# Altium schematic sheet Sheet1.SchDoc
size C; SheetNumber: 1; SheetTotal: 1; SPICEModelCacheWPHGAQRQ: <root> / <DocumentId>WPHGAQRQ</DocumentId> / <CacheFrame Number="0"> / <Model Name="diode" Kind="MDL"> / <Text>*Default Diode / *Diode Pinout: A,K / .MODEL DIODE D()</Text> / </Model> / </CacheFrame> / </root>
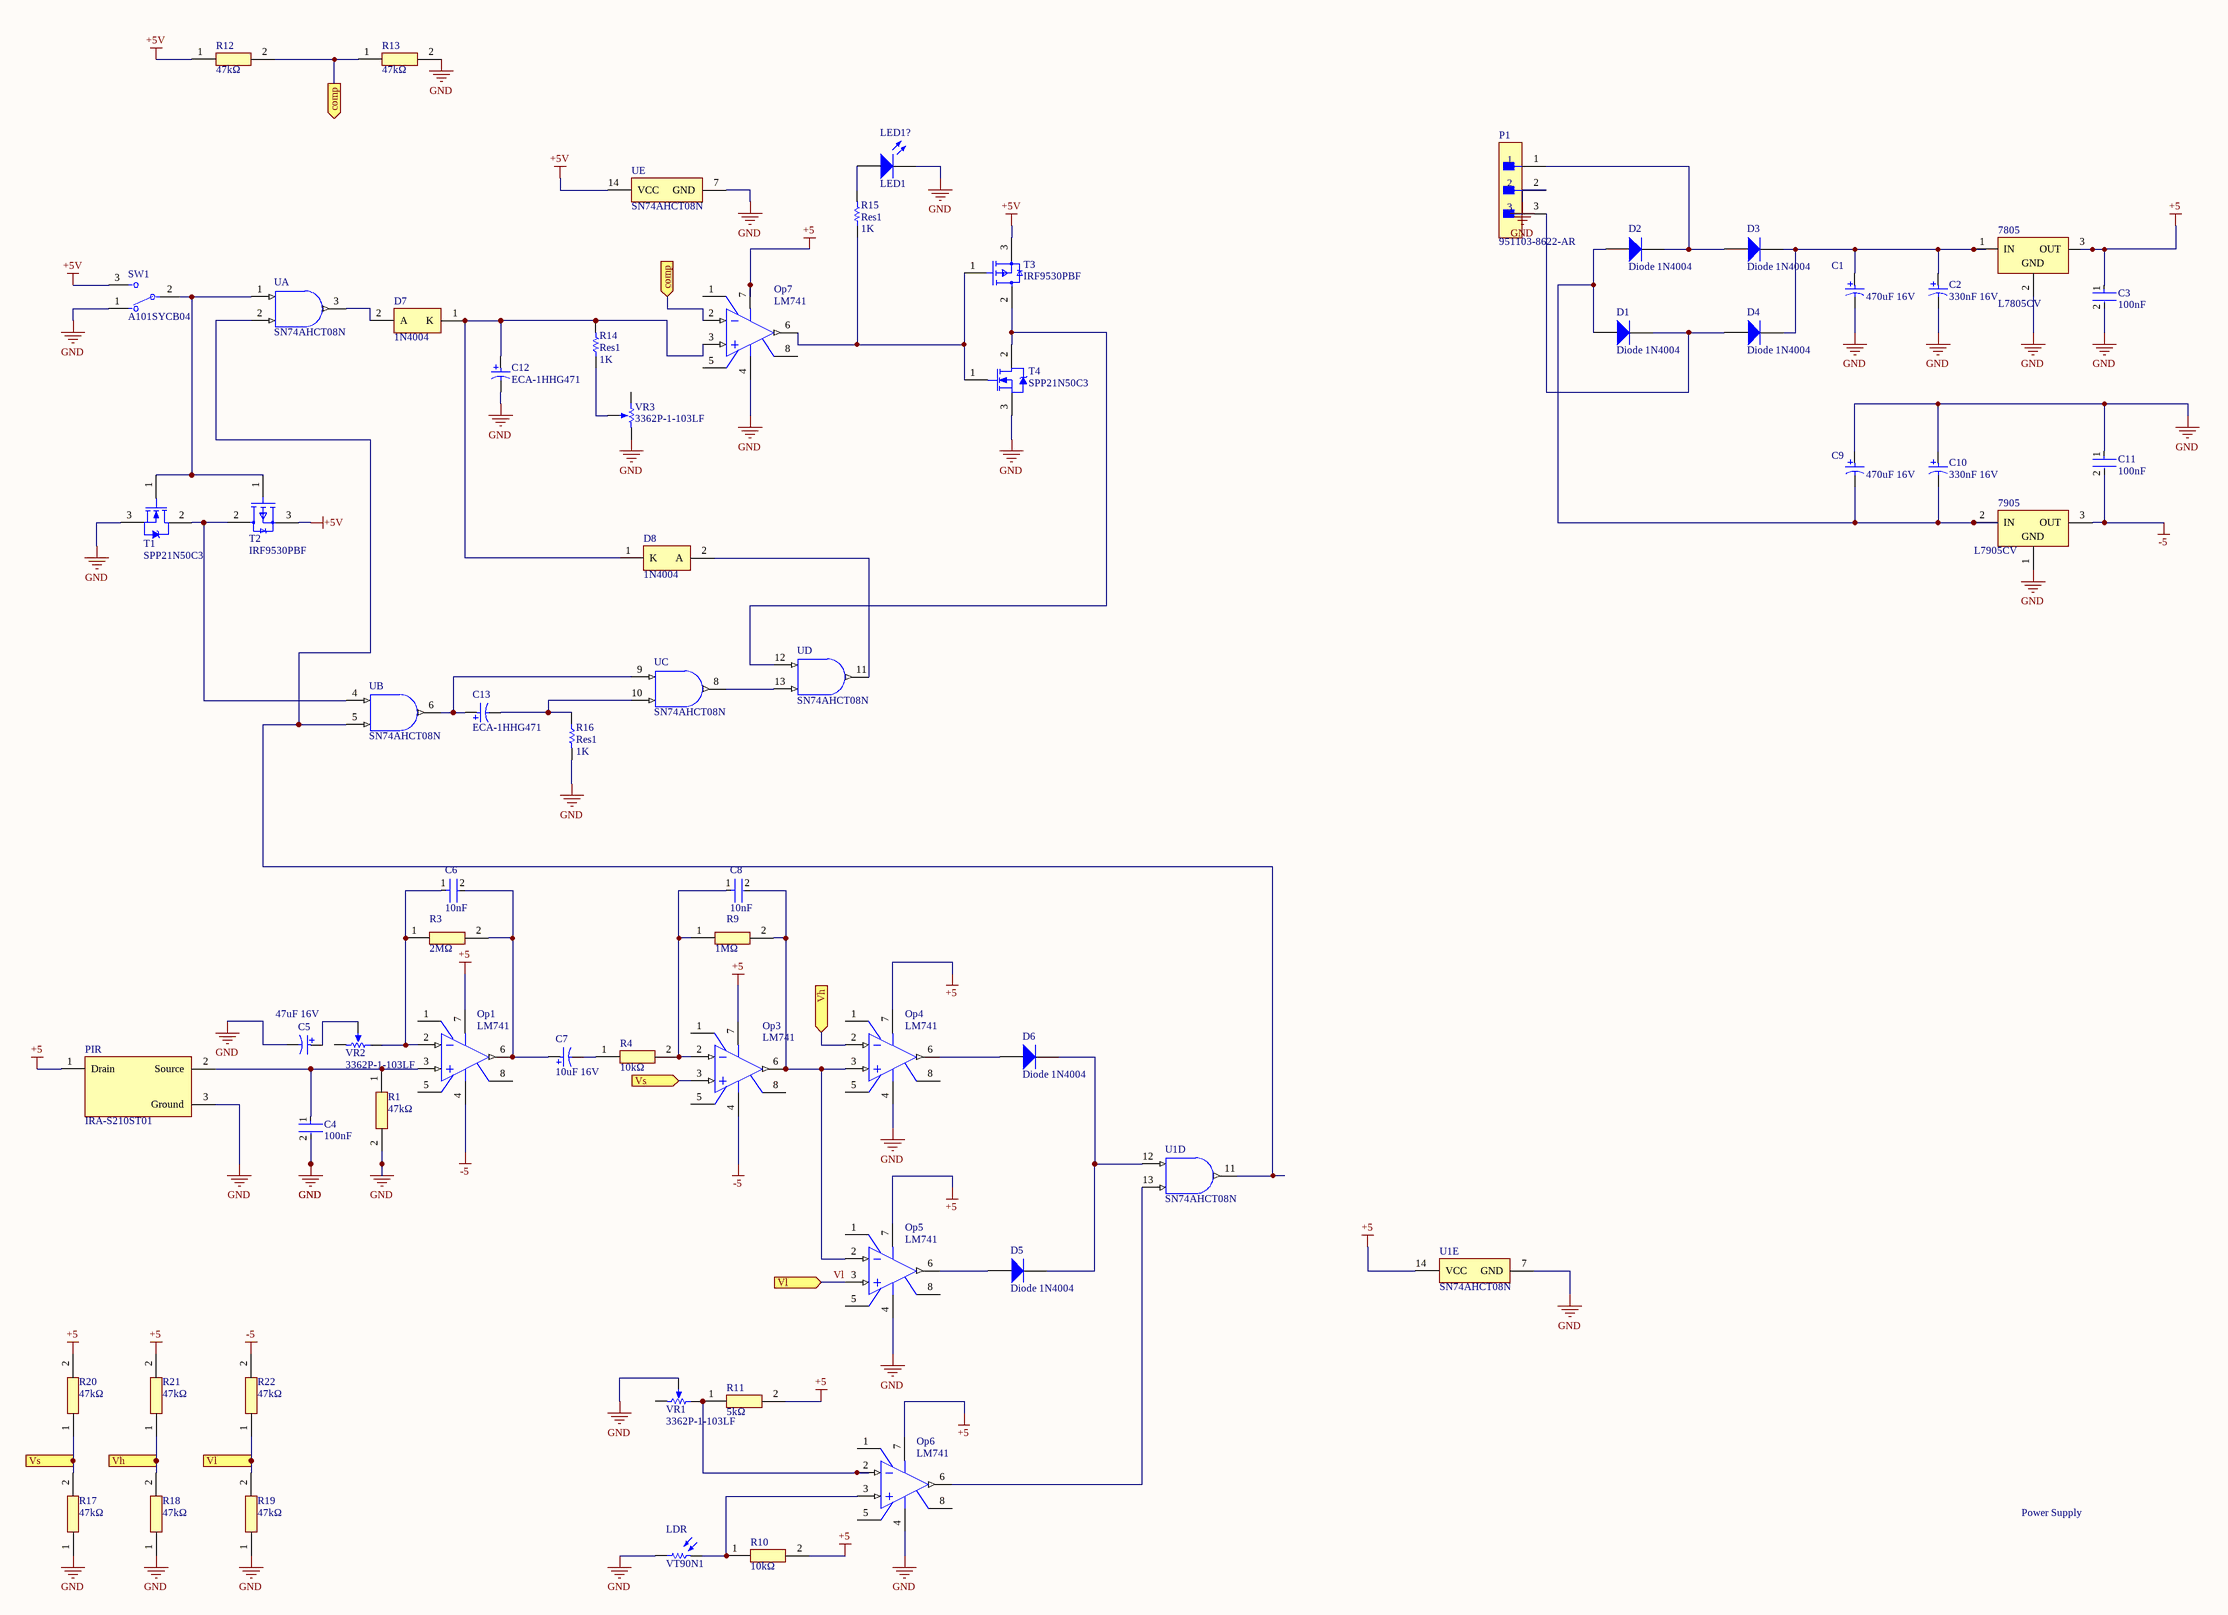
[diagram p0: Sheet1.SchDoc]

## Parts
7805  L7805CV  [TO220]
7905  L7905CV  [TO-220]
C1  470uF 16V  [CAPPR65-350-1150X800X1250]
C2  330nF 16V  [CAPPR65-350-1150X800X1250]
C3  100nF  [FP-K15H5-MFG]
C4  100nF  [FP-K15H5-MFG]
C5  47uF 16V  [CAPPR65-350-1150X800X1250]
C6  10nF  [FP-K15H5-MFG]
C7  10uF 16V  [CAPPR65-350-1150X800X1250]
C8  10nF  [FP-K15H5-MFG]
C9  470uF 16V  [CAPPR65-350-1150X800X1250]
C10  330nF 16V  [CAPPR65-350-1150X800X1250]
C11  100nF  [FP-K15H5-MFG]
C12  ECA-1HHG471  [PNSC-CAP-10x20-P2]
C13  ECA-1HHG471  [PNSC-CAP-10x20-P2]
D1  Diode 1N4004  [DO-41]
D2  Diode 1N4004  [DO-41]
D3  Diode 1N4004  [DO-41]
D4  Diode 1N4004  [DO-41]
D5  Diode 1N4004  [DO-41]
D6  Diode 1N4004  [DO-41]
D7  1N4004  [ONSC-AXIAL_LEAD-2-59-10_P]
D8  1N4004  [ONSC-AXIAL_LEAD-2-59-10_P]
LDR  VT90N1  [EXCE-VT90N1]
LED1?  LED1  [LED-1]
Op1  LM741  [P0008A]
Op3  LM741  [P0008A]
Op4  LM741  [P0008A]
Op5  LM741  [P0008A]
Op6  LM741  [P0008A]
Op7  LM741  [P0008A]
P1  951103-8622-AR  [FP-951103-8622-AR-MFG]
PIR  IRA-S210ST01  [FP-IRA-S210ST01-MFG]
R1  47kΩ  [RESAD1650W60L650D250]
R3  2MΩ  [RESAD1650W60L650D250]
R4  10kΩ  [RESAD1650W60L650D250]
R9  1MΩ  [RESAD1650W60L650D250]
R10  10kΩ  [RESAD1650W60L650D250]
R11  5kΩ  [RESAD1650W60L650D250]
R12  47kΩ  [RESAD1650W60L650D250]
R13  47kΩ  [RESAD1650W60L650D250]
R14  Res1  value 1K  [AXIAL-0.3]
R15  Res1  value 1K  [AXIAL-0.3]
R16  Res1  value 1K  [AXIAL-0.3]
R17  47kΩ  [RESAD1650W60L650D250]
R18  47kΩ  [RESAD1650W60L650D250]
R19  47kΩ  [RESAD1650W60L650D250]
R20  47kΩ  [RESAD1650W60L650D250]
R21  47kΩ  [RESAD1650W60L650D250]
R22  47kΩ  [RESAD1650W60L650D250]
SW1  A101SYCB04  [FP-A101SYCB04-MFG]
T1  SPP21N50C3  [INF-PG-TO220-3-1]
T2  IRF9530PBF  [FP-X15-0364-MFG]
T3  IRF9530PBF  [FP-X15-0364-MFG]
T4  SPP21N50C3  [INF-PG-TO220-3-1]
U  SN74AHCT08N  [N0014A]  (parts A,B,C,D,E of 5)
U1  SN74AHCT08N  [N0014A]  (parts D,E of 5)
VR1  3362P-1-103LF  [BOUR-3362P]
VR2  3362P-1-103LF  [BOUR-3362P]
VR3  3362P-1-103LF  [BOUR-3362P]

## Ports
comp (in), comp (out), Vh (in), Vh (out), Vl (in), Vl (out), Vs (in), Vs (out)

## Nets
+5: 7805.3(OUT) C3.1 Op1.7(V+) Op3.7(V+) Op4.7(V+) Op5.7(V+) Op6.7(V+) Op7.7(V+) PIR.1(Drain) R10.2 R11.2 R20.2 R21.2 U1.14(VCC)
+5V: R12.1 SW1.3 T2.3(S) T3.3(S) U.14(VCC)
-5: 7905.3(OUT) C11.2 Op1.4(V-) Op3.4(V-) R22.2
GND: 7805.2(GND) 7905.1(GND) C1.2 C2.2 C3.2 C4.2 C5.2 C9.1 C10.1 C11.1 C12.2 LDR.1 LED1?.2(K) Op4.4(V-) Op5.4(V-) Op6.4(V-) Op7.4(V-) P1.2 PIR.3(Ground) R1.2 R13.2 R16.2 R17.1 R18.1 R19.1 SW1.1 T1.3(SOURCE) T4.3(SOURCE) U.7(GND) U1.7(GND) VR1.2(S) VR3.3(CW)
comp: Op7.2(IN-) R12.2 R13.1 ; port comp
Vh: Op4.2(IN-) R18.2 R21.1 ; port Vh
Vl: Op5.3(IN+) R19.2 R22.1 ; port Vl
Vs: Op3.3(IN+) R17.2 R20.1 ; port Vs
Net7805_1: 7805.1(IN) C1.1 C2.1 D3.2(K) D4.2(K)
Net7905_2: 7905.2(IN) C9.2 C10.2 D1.1(A) D2.1(A)
NetC4_1: C4.1 Op1.3(IN+) PIR.2(Source) R1.1
NetC5_1: C5.1 VR2.2(S)
NetC6_1: C6.1 Op1.2(IN-) R3.1 VR2.1(CCW)
NetC6_2: C6.2 C7.1 Op1.6(OUT) R3.2
NetC7_2: C7.2 R4.1
NetC8_1: C8.1 Op3.2(IN-) R4.2 R9.1
NetC8_2: C8.2 Op3.6(OUT) Op4.3(IN+) Op5.2(IN-) R9.2
NetC12_1: C12.1 D7.1(K) D8.1(K) Op7.3(IN+) R14.2
NetC13_1: C13.1 U.6(2Y) U.9(3A)
NetC13_2: C13.2 R16.1 U.10(3B)
NetD1_2: D1.2(K) D4.1(A) P1.3
NetD2_2: D2.2(K) D3.1(A) P1.1
NetD5_1: D5.1(A) Op5.6(OUT)
NetD5_2: D5.2(K) D6.2(K) U1.12(4A)
NetD6_1: D6.1(A) Op4.6(OUT)
NetD7_2: D7.2(A) U.3(1Y)
NetD8_2: D8.2(A) U.11(4Y)
NetLDR_2: LDR.2 Op6.3(IN+) R10.1
NetLED1?_1: LED1?.1(A) R15.2
NetOp6_2: Op6.2(IN-) R11.1 VR1.1(CCW)
NetOp6_6: Op6.6(OUT) U1.13(4B)
NetOp7_6: Op7.6(OUT) R15.1 T3.1(G) T4.1(GATE)
NetR14_1: R14.1 VR3.2(S)
NetSW1_2: SW1.2 T1.1(GATE) T2.1(G) U.1(1A)
NetT1_2: T1.2(DRAIN) T2.2(D) U.4(2A)
NetT3_2: T3.2(D) T4.2(DRAIN) U.12(4A)
NetU_2: U.2(1B) U.5(2B) U1.11(4Y)
NetU_8: U.8(3Y) U.13(4B)

Not connected (* = marked no-connect by the designer): Op1 1(OFS_NULL) 5(OFS_NULL) 8(NC); Op3 1(OFS_NULL) 5(OFS_NULL) 8(NC); Op4 1(OFS_NULL) 5(OFS_NULL) 8(NC); Op5 1(OFS_NULL) 5(OFS_NULL) 8(NC); Op6 1(OFS_NULL) 5(OFS_NULL) 8(NC); Op7 1(OFS_NULL) 5(OFS_NULL) 8(NC); VR1 3(CW); VR2 3(CW); VR3 1(CCW)

## Notes on the sheet
- Power Supply

## Library data of the parts
7805 = CMP-0244-00483-1: Positive Voltage Regulator, 5V, 3-Pin TO-220; PackageDescription: TO, Thru-Hole, Vertical, Heatsink Mounted; 3 In-Line Leads; Pitch 2.54 mm; ComponentLink2Description: Datasheet; PackageReference: TO220; ComponentLink3URL: http://www.st.com/internet/com/TECHNICAL_RESOURCES/TECHNICAL_LITERATURE/PACKAGE_INFORMATION/CD00004649.pdf; DatasheetVersion: 16/11/2011; ComponentLink1Description: Manufacturer URL; ComponentLink1URL: http://www.st.com; PackageVersion: ver3.0; ComponentLink3Description: Package Specification; ComponentLink2URL: http://www.st.com/internet/com/TECHNICAL_RESOURCES/TECHNICAL_LITERATURE/DATASHEET/CD00000444.pdf
7905 = CMP-0244-00447-1: Negative Voltage Regulator, -5V, 3-Pin TO-220; ComponentLink2Description: Datasheet; DatasheetVersion: 1/11/2011; ComponentLink2URL: http://www.st.com/internet/com/TECHNICAL_RESOURCES/TECHNICAL_LITERATURE/DATASHEET/CD00000450.pdf; ComponentLink1Description: Manufacturer URL; PackageDescription: TO, Thru-Hole, Vertical, Heatsink Mounted; 3 In-Line Leads; Pitch 2.54 mm; ComponentLink1URL: http://www.st.com; PackageReference: TO-220; PackageVersion: 2011
C1 C2 C5 C7 C9 C10 = CMP-1665-00042-2: Aluminum Electrolytic Capacitor, 100 uF, +/- 20%, 50 V, -40 to 85 degC, 2-Pin THD, RoHS, Bulk; Manufacturer: Panasonic; Lead Diameter: 0.6mm; Dielectric Material: Aluminium; Voltage Rating (DC): 50V; Ripple Current (AC): 250mA; Polarity: Polar; Leakage Current: 3uA; Capacitance: 100uF; Life (Hours): 2000Hour; Lead/Base Style: Straight; Dissipation Factor: 0.12%; Radiation Hardening: No; Height: 11.5mm; Package Quantity: 200; Package Reference: CAPPR65-350-1150X800X1250; Min Operating Temperature: -40degC; Mount: ThroughHole; Package Description: 2-Pin Radial Lead, Dia 8 mm, Height 12.5 mm; Case/Package: Radial; Diameter: 8mm; Voltage Rating: 50V; Length: 11.5mm; REACH SVHC: NoSVHC; Height - Seated (Max): 0.492inch; Datasheet URL: https://industrial.panasonic.com/cdbs/www-data/pdf/RDF0000/ABA0000C1218.pdf; RoHSCompliant: true; Ripple Current: 250mA; Lead Free: LeadFree; Voltage: 50V; Manufacturer URL: http://www.panasonic.com/; Number of Pins: 2; Datasheet Version: Rev. 05, 10/2016; Packaging: Bulk; Termination: Radial; Max Operating Temperature: 85degC; Tolerance: 20%; Lead Pitch: 3.5mm
C3 C4 C11 = CMP-02417-000048-1: CAP CER 0.1UF 50V X7R RADIAL; Tolerance: 10%; Lead/Base Style: Formed Leads; Lead Length: 30mm; Lead Diameter: 0.5mm; Radiation Hardening: No; Capacitance: 100nF; Lead Pitch: 5mm; Voltage: 50V; Mount: Through Hole; Package Quantity: 5000; Series: K; Case/Package: Dipped; Min Operating Temperature: -55°C; Depth: 2.5mm; Height - Seated (Max): 0.1inch; Voltage Rating (DC): 50V; Packaging: Bulk; RoHS Compliant: Yes; Construction: RADIAL; Thickness: 2.6mm; Max Operating Temperature: 125°C; Voltage Rating: 50V; Diameter: 500um; Dielectric: X7R; Width: 2.5mm; Length: 4mm; Weight: 0.005644oz; Termination: Radial; Height: 4mm
C6 C8 = CMP-02417-000048-1: CAP CER 0.1UF 50V X7R RADIAL; Capacitance: 100nF; Tolerance: 10%; Lead/Base Style: Formed Leads; Lead Length: 30mm; Lead Diameter: 0.5mm; Radiation Hardening: No; Lead Pitch: 5mm; Voltage: 50V; Mount: Through Hole; Package Quantity: 5000; Series: K; Case/Package: Dipped; Min Operating Temperature: -55°C; Depth: 2.5mm; Height - Seated (Max): 0.1inch; Voltage Rating (DC): 50V; Packaging: Bulk; RoHS Compliant: Yes; Construction: RADIAL; Thickness: 2.6mm; Max Operating Temperature: 125°C; Voltage Rating: 50V; Diameter: 500um; Dielectric: X7R; Width: 2.5mm; Length: 4mm; Weight: 0.005644oz; Termination: Radial; Height: 4mm
C12 C13 = CMP-2000-05308-1: Aluminum Electrolytic Capacitor, 470 uF, +/- 20%, 50 V, -55 to 105 degC, 2-Pin THD, RoHS, Bulk; Manufacturer: Panasonic; Package Version: Nov-12; Type: Radial; Lifetime@Temperature: 2000Hrs@105degC; Capacitance: 470µF; Rated Voltage: 50V; Ripple Current: 530mA; Case Size/Dimension: Ø10x20mm; Package Reference: CAP-10x20-P2; Package Description: 2-Pin Through Hole Device, Dia 10 mm, Body Length 20 mm, Pin Spacing 5 mm; Series: NHG; Datasheet Version: Nov-12; Datasheet URL: http://www.alliedelec.com/images/products/datasheets/bm/Panasonic/70067776.pdf; Package URL: http://www.alliedelec.com/images/products/datasheets/bm/Panasonic/70067776.pdf; Operating Temp-Max: 105degC; Operating Temp Range: -55to+105degC; Manufacturer URL: http://www.panasonic.com/
D1-D6 = Diode 1N4004: 1 Amp General Purpose Rectifier; Published: 8-Jun-2000; LatestRevisionDate: 17-Jul-2002; LatestRevisionNote: Re-released for DXP Platform.; DatasheetVersion: 1998; PackageVersion: Aug-1999; PackageReference: DO-41; Publisher: Altium Limited; PackageDescription: Diode, Axial; Body 5.2 x 2.7 mm (LxDia. max), Lead Dia. 0.86 mm (max); Code_JEDEC: DO-204-AL; ComponentLink1Description: Manufacturer Link; ComponentLink1URL: http://www.fairchildsemi.com/; ComponentLink2Description: Datasheet; ComponentLink2URL: http://www.fairchildsemi.com/ds/1N%2F1N4001.pdf
D7 D8 = CMP-0902-00115-1: Standard Recovery Rectifier, 2-Pin Axial_Lead, Pb-Free, Bulk Bag; Manufacturer: On Semiconductor; IFSM Max (A): 30; IO(rec) Max (A): 1; VRRM Max (V): 400; Type: Standard Recovery; Packing: Bulk Bag; PackageVersion: Rev. U, 02/2005; ComponentLink1URL: http://www.onsemi.com/; ComponentLink3URL: http://www.onsemi.cn/pub_link/Collateral/59-10.PDF; DatasheetVersion: Rev. 13; PartNumber: 1N4004; ComponentLink1Description: Manufacturer URL; Mounting Technology: Through Hole; PackageReference: AXIAL_LEAD-2-59-10; ComponentLink3Description: Package Specification; ComponentLink2URL: http://www.onsemi.com/pub_link/Collateral/1N4001-D.PDF; ComponentLink2Description: Datasheet; PackageDescription: 2-Pin, Axial Lead, Diameter 2.35 mm; RoHS: TRUE
LDR = CMP-2000-07406-1: Photoconductive Resistor, 200 kOhm, 100 V, 80 mW, -40 to 75 degC, 2-Pin THD, RoHS; Manufacturer: Excelitas Technology; SVHC: Cadmiumchloride(15-Jun-2015); Power Rating: 80mW; Resistance @ Lux: 12kohm; Voltage Rating: 100V; Product Range: -; Datasheet Version: 09/2006; Resistor Case Style: -; Operating Temperature Max: 75°C; Package Reference: VT90N1; Datasheet URL: http://datasheet.octopart.com/VT90N1-Excelitas-datasheet-10388451.pdf; Mounting Technology: ThroughHole; Operating Temperature Min: -40°C; Dark Resistance: 200kohm; Package Description: 2-Pin Through Hole Device, Body Width 4.17 mm (Max), Height 2.29 mm; Manufacturer URL: http://www.excelitas.com/Pages/Index.aspx; Packaging: Each
LED1? = LED1: Typical RED GaAs LED; Published: 8-Jun-2000; LatestRevisionDate: 08-Jul-2005; LatestRevisionNote: Mech Layer 1 removed.; PackageReference: LED-1; Publisher: Altium Limited; PackageDescription: LED; 2 Leads
Op1 Op3-Op7 = CMP-0055-00162-3: Operational Amplifier, 8-pin MDIP, Pb-Free; Manufacturer: Texas Instruments; PackageTopMarking: NSUZXYTTE#*LM*741CN; PowerWise: N; CompType: Amplifiers; ComponentLink1Description: Datasheet URL; ComponentLink1URL: http://www.ti.com/general/docs/lit/getliterature.tsp?genericPartNumber=LM741&fileType=pdf; PackageDescription: MDIP, .365 x .250 x .130in, 8 Lead, .100in Pitch; RoHS: Y; PinCount: 8; Code_JEDEC: MS-001-BA; Package Reference: P0008A
P1 = CMP-05379-000003-1: CONN HEADER VERT 3POS 2MM; Manufacturer: 3M; Conn Gender: Male; Current Rating: 2A; Number Of Contacts: 3; Conn Orientation: Straight; Digikey Description: CONN HEADER VERT 3POS 2MM; Device Class L3: unset; Category: Conn; Height: 6.3mm; Manufacturer Part Number: 951103-8622-AR; RoHS: TRUE; Contact Material: Gold,Nickel; ComponentLink2Description: Datasheet; Temperature Range Low: -55°C; Device Class L1: Connectors; Pitch: 2mm; Mouser Description: Header; PinStrip; CopperAlloy; HighTempThermoplastic; 3Cnts; 1A; RtAngle; 951Series; Octopart: https://octopart.com/951103-8622-ar-3m-14400669; Package: 951103-8622-AR; Lead Free: Yes; Device Class L2: Headers and Wire Housings; Temperature Range High: +125°C; ComponentLink2URL: http://multimedia.3m.com/mws/media/1400506O/3m-pin-strip-header-951-series-78-5100-2653-3.pdf; Automotive: No; Temperature: -55°C to +125°C; Number Of Rows: 1
PIR = CMP-06150-000001-1: MOTION SENSOR; Manufacturer: Murata; Min Supply Voltage: 2V; Max Supply Voltage: 15V; Device Class L3: Photoelectric Sensors; Package: IRA-S210ST01; Temperature Range Low: -40°C; Temperature Range High: +70°C; ComponentLink2Description: Datasheet; Category: IC; ComponentLink2URL: https://www.murata.com/en-us/api/pdfdownloadapi?cate=luInfraredSensors&partno=IRA-S210ST01; Digikey Description: MOTION SENSOR; Manufacturer Part Number: IRA-S210ST01; Octopart: https://octopart.com/ira-s210st01-murata-30987376; Temperature: -40°C to +70°C; Lead Free: Yes; Automotive: No; RoHS: TRUE; Device Class L1: Sensors; Height: 4.9mm; Device Class L2: Optical Sensors
R1 R3 R4 R9-R13 R17-R22 = MRS25000C1002FC100: Resistor; Manufacturer_Name: Vishay; Datasheet Link: http://www.vishay.com/docs/28724/mrs16m25.pdf; Manufacturer_Part_Number: MRS25000C1002FC100; Mouser Part Number: 594-2322-156-11003; Mouser Price/Stock: https://www.mouser.co.uk/ProductDetail/Vishay-BC-Components/MRS25000C1002FC100?qs=B52Dqq1Chl6h6M7hjffcZQ%3D%3D; Arrow Part Number: MRS25000C1002FC100; Arrow Price/Stock: https://www.arrow.com/en/products/mrs25000c1002fc100/vishay
R14-R16 = Res1: Resistor; Published: 8-Jun-2000; LatestRevisionDate: 17-Jul-2002; LatestRevisionNote: Re-released for DXP Platform.; PackageReference: AXIAL-0.3; Publisher: Altium Limited; PackageDescription: Axial Device, Thru-Hole; 2 Leads; 0.3 in Pin Spacing
SW1 = CMP-03408-000017-1: SWITCH TOGGLE SPDT 0.4VA 20V; Electrical Life: 6000Cycles; Number of Poles: 1; Power Rating: 400mW; Switch Function: On-On; Contact Resistance: 10mR; Contact Current Rating: 400mA; Actuator Material: Phenolic; Insulation Resistance: 30MR; Actuator Color: Chrome; Number of Positions: 2; Actuator Type: Standard Round; Actuator Length: 10.41mm; Illumination Type: Non-Illuminated; Flammability Rating: UL94 V-1; Contact Material: Copper; Depth: 6.86mm; Contact Plating: Gold; Voltage Rating (AC): 20V; Max Voltage Rating (DC): 20V; Min Operating Temperature: -30°C; Max Operating Temperature: 85°C; Throw Configuration: SPDT; Packaging: Bulk; Termination: PC Pins; Series: Gemini A; ELV: Compliant; Lead Free: Lead Free; RoHS Compliant: Yes; REACH SVHC: No SVHC; Mount: Panel; Orientation: Straight; Package Quantity: 100; Max Voltage Rating (AC): 20V; Radiation Hardening: No; Voltage Rating (DC): 20V
T1 T4 = CMP-1164-00015-1: N-Channel CoolMOS Power-Transistor, 500 V VDS, 21 A ID, -55 to 150 degC, PG-TO220-3-1, Tube, Green; Manufacturer: Infineon; Rth: 0.6Â K/W; Green: TRUE; VGS(th) (max): 3.9Â V; Polarity: N; RDS (on) (max): 190Â mOhm; ID (max): 21Â A; Ptot (max): 208Â W; IDpuls (max): 63Â A; QG: 95Â nC; RthJA (max): 62Â K/W; VDS (max): 500Â V; VGS(th) (min): 2.1Â V; PartNumber: SPP21N50C3; PackageDescription: 3-Pin Plastic (Green) Transistor Single Outline Package, 10 x 9.25 mm Body, 2.54 mm Pitch; PackageReference: PG-TO220-3-1; ComponentLink1URL: http://www.infineon.com/; ComponentLink2URL: http://www.infineon.com/dgdl/SPP_I_A21N50C3_Rev%5B1%5D.3.2%2Bnew.pdf?folderId=db3a304412b407950112b408e8c90004&fileId=db3a304412b407950112b42cf25f47d8; ComponentLink2Description: Datasheet; ComponentLink3Description: Package Specification; ComponentLink3URL: http://www.infineon.com/dgdl/BTS117_DS_14.pdf?folderId=db3a30431400ef68011421b54e2e0564&fileId=db3a30433a747525013abff8302d549c&location=en.Products.Automotive_ICs.Smart_High-_and_Low-Side_Switches.HITFET___TEMPFET__-_Smart_Low-Side_Switches.DATASHEET.BTS1; Technology: CoolMOS C3; RthJC (max): 0.6Â K/W; PackageVersion: Jul-12; Packing: Tube; DatasheetVersion: Rev. 3.2; Mounting Technology: Through Hole; ComponentLink1Description: Manufacturer URL
T2 T3 = CMP-02550-000233-1: MOSFET P-CH 100V 12A TO-220AB; Drain to Source Breakdown Voltage: -100V; On-State Resistance: 300mR; Gate to Source Voltage (Vgs): 20V; Recovery Time: 240ns; Power Dissipation: 88W; Threshold Voltage: -4V; Number of Channels: 1; Current Rating: -12A; Fall Time: 39ns; Polarity: P-CHANNEL; Turn-On Delay Time: 12ns; Element Configuration: Single; Input Capacitance: 860pF; Rise Time: 52ns; Turn-Off Delay Time: 31ns; Polarization: P; Lead Free: Lead Free; RoHS Compliant: Yes; Radiation Hardening: No; Width: 4.7mm; Drain to Source Resistance: 300mR; Package Quantity: 50; Height: 9.01mm; Length: 10.41mm; Rds On Max: 300mR; Min Operating Temperature: -55°C; Case/Package: TO-220AB; Continuous Drain Current (ID): 12A; Number of Pins: 3; Weight: 0.211644oz; Max Operating Temperature: 175°C; Series: -; Max Power Dissipation: 88W; Voltage Rating (DC): -100V; Mount: Through Hole; Packaging: Rail/Tube; Number of Elements: 1; Drain-source On Resistance-Max: 300mR; Drain to Source Voltage (Vdss): 100V
U U1 = CMP-0777-00278-3: Quadruple 2-Input Positive-AND Gates, N0014A, TUBE; Manufacturer: Texas Instruments; ICC @ Nom Voltage(Max)(mA): 0.02; Rating: Catalog; VCC(Max)(V): 5.5; Input Type: TTL; F @ Nom Voltage(Max)(Mhz): 70; VCC(Min)(V): 4.5; Output Drive (IOL/IOH)(Max)(mA): -8/8; Schmitt Trigger: No; Voltage(Nom)(V): 5; Output Type: CMOS; tpd @ Nom Voltage(Max)(ns): 8; Bits(#): 4; Technology Family: AHCT; Generic Part Number: SN74AHCT08; DatasheetVersion: SCLS237M; PackageReference: N0014A; Operating Temperature Range(C): -40 to 125,-40 to 85
VR1-VR3 = CMP-1747-00004-1: Square Trimpot(R) Trimming Potentiometer, 10 KOhm, 300 V, -55 to 125 degC, 3-Pin THD, RoHS, Tube; Voltage Rating: 220 mV; Power Rating: 1 W; Tolerance: 1%; Resistance: 50 mohm; Case/Package: 1206; Length: 3.2 mm; RoHSCompliant: True; PackageDescription: 3-Pin Through Hole Device, Body 6.6 x 6.99 mm, Pitch 2.54 mm; ComponentLink2Description: Datasheet; REACH SVHC: No SVHC; Mount: Surface Mount; Height: 0.6 mm; Packaging: Tape and Reel; ComponentLink1URL: http://www.bourns.com/; Case Code (Imperial): 0612; Pins: 2; Case Code (Metric): 1632; ComponentLink2URL: http://www.bourns.com/docs/Product-Datasheets/3362.pdf; Min Operating Temperature: -25degC; ComponentLink1Description: Manufacturer URL; PackageReference: 3326P; Max Operating Temperature: 125degC; Width: 1.6 mm; Package Quantity: 5000; DatasheetVersion: May-16